# Altium schematic sheet Amplifier.SchDoc
size A4; SheetNumber: 4; SheetTotal: 7
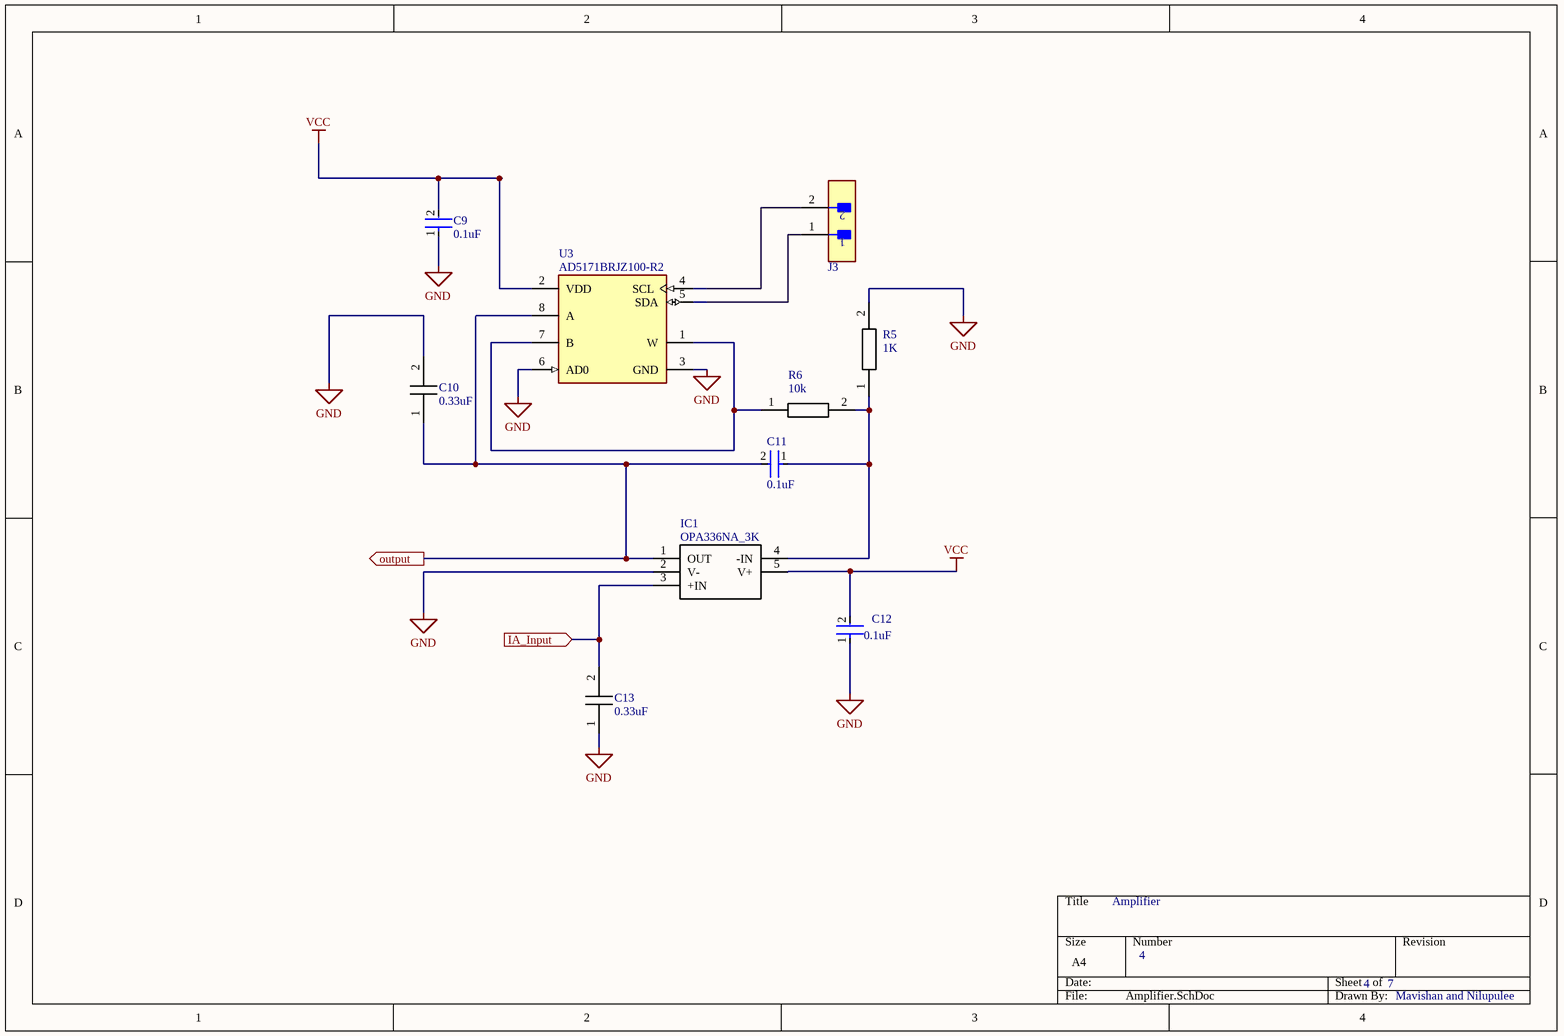
[diagram p0: Amplifier.SchDoc]

## Parts
C9  0.1uF  [FP-C1206C-EB-MFG]
C10  Parameter 1: 0.33uF  [CAPC3216X127N]  (hidden comment: 12063C334MAT2A)
C11  0.1uF  [FP-C1206C-EB-MFG]
C12  0.1uF  [FP-C1206C-EB-MFG]
C13  Parameter 1: 0.33uF  [CAPC3216X127N]  (hidden comment: 12063C334MAT2A)
IC1  OPA336NA_3K  [SOT95P280X145-5N]
J3  M20-9990246  [FP-M20-9990246-MFG]  (value not drawn)
R5  Parameter 1: 1K  [RESC3216X70N]  (hidden comment: ERA8AEB102V)
R6  Parameter 1: 10k  [RESC3216X70N]  (hidden comment: ERA-8AEB103V)
U3  AD5171BRJZ100-R2  [FP-RJ-8-IPC_A]

## Ports
IA_Input (in, see Main PCB[3B]), output (out, see Main PCB[3B])

## Nets
GND: C9.1 C10.2(C2) C12.1 C13.1(C1) IC1.2(V-) R5.2 U3.3(GND) U3.6(AD0)
VCC: C9.2 C12.2 IC1.5(V+) U3.2(VDD)
IA_Input: C13.2(C2) IC1.3(+IN) ; port IA_Input
output: C10.1(C1) C11.2 IC1.1(OUT) U3.8(A) ; port output
NetC11_1: C11.1 IC1.4(-IN) R5.1 R6.2
NetJ3_1: J3.1 U3.5(SDA)
NetJ3_2: J3.2 U3.4(SCL)
NetR6_1: R6.1 U3.1(W) U3.7(B)

## Notes on the sheet
- Amplifier
- 4
- 7
- Mavishan and Nilupulee

## Library data of the parts
C9 C11 C12 = CMP-1037-04186-2: CAP CER 0.1UF 25V C0G/NP0 1206; Manufacturer: KEMET; Manufacturer Part Number: C1206C104F3GACTU; Material: Ceramic; Value: 0.10 μF; Temperature Characteristic: C0G; Temperature Coefficient: 15%; Tolerance: 0.01; Automotive Grade: Grade 0; Device Class L3: Ceramic Capacitors; Voltage Rating: 25 V; Temperature Range Low: -55°C; RoHS: TRUE; Package: C1206C-EB; Category: Cap; Lead Free: Yes; ComponentLink2URL: https://content.kemet.com/datasheets/KEM_C1007_X8R_ULTRA_150C_SMD.pdf; Ipc Land Pattern Name: CAPC320160X78; Temperature Range High: +150°C; Height: 0.88mm; Digikey Description: CAP CER 0.1UF 25V C0G/NP0 1206; ComponentLink2Description: Datasheet; Capacitance: 0.10 μF; Mouser Description: Multilayer Ceramic Capacitors MLCC - SMD/SMT 25volts 0.1uF 1% C0G; Octopart: https://octopart.com/c1206c104f3gactu-kemet-13149870; Device Class L1: Passive Components; Device Class L2: Capacitors; Automotive: Yes; Temperature: -55°C to +150°C
C10 C13 = 12063C334MAT2A: Capacitor; Manufacturer_Name: Kyocera AVX; Manufacturer_Part_Number: 12063C334MAT2A; Mouser Part Number: 581-12063C334MAT2A; Mouser Price/Stock: https://www.mouser.co.uk/ProductDetail/AVX/12063C334MAT2A?qs=UY55afH%252BLTTA4%2F7p5aIkng%3D%3D
IC1 = OPA336NA_3K: Integrated Circuit; Manufacturer_Name: Texas Instruments; Manufacturer_Part_Number: OPA336NA/3K; Datasheet Link: http://www.ti.com/lit/gpn/OPA336; Height: 1.45mm; Mouser Part Number: 595-OPA336NA/3K; Mouser Price/Stock: https://www.mouser.co.uk/ProductDetail/Texas-Instruments/OPA336NA-3K?qs=7nS3%252BbEUL6vwF%252Byt2%2F21Rw%3D%3D; Arrow Part Number: OPA336NA/3K; Arrow Price/Stock: https://www.arrow.com/en/products/opa336na3k/texas-instruments?region=nac
J3 = CMP-15831-000009-1: CONN HEADER VERT 2POS 2.54MM; Manufacturer: Harwin; Conn Gender: Male; Conn Orientation: Vertical; Number Of Contacts: 2; Current Rating: 3A; ComponentLink2URL: https://cdn.harwin.com/pdfs/M20-999.pdf; ComponentLink2Description: Datasheet; Package: M20-9990246; Temperature: -40°C to +105°C; Octopart: https://octopart.com/m20-9990246-harwin-2590635; Mouser Description: 2.54mm (0.1") Pitch SIL Vertical PC Tail Pin Header, 6.1mm mating pin height, tin, 2 contacts; Temperature Range High: +105°C; Device Class L1: Connectors; RoHS: TRUE; Automotive: No; Height: 8.99mm; Number Of Rows: 1; Contact Material: Tin,Nickel; Category: Conn; Pitch: 2.54mm; Lead Free: Yes; Digikey Description: CONN HEADER VERT 2POS 2.54MM; Manufacturer Part Number: M20-9990246; Temperature Range Low: -40°C; Device Class L3: unset; Device Class L2: Headers and Wire Housings
R5 = ERA8AEB102V: Resistor; Manufacturer_Name: Panasonic; Datasheet Link: https://industrial.panasonic.com/cdbs/www-data/pdf/RDM0000/AOA0000C307.pdf; Height: 0.7mm; Manufacturer_Part_Number: ERA8AEB102V; Arrow Part Number: ERA8AEB102V; Arrow Price/Stock: https://www.arrow.com/en/products/era-8aeb102v/panasonic
R6 = ERA-8AEB103V: Resistor; Manufacturer_Name: Panasonic; Datasheet Link: https://industrial.panasonic.com/cdbs/www-data/pdf/RDM0000/AOA0000C307.pdf; Height: 0.7mm; Manufacturer_Part_Number: ERA-8AEB103V; Mouser Part Number: 667-ERA-8AEB103V; Mouser Price/Stock: https://www.mouser.co.uk/ProductDetail/Panasonic/ERA-8AEB103V?qs=Ojoo2rCVP9QscDrGu5R0Gw%3D%3D; Arrow Part Number: ERA-8AEB103V; Arrow Price/Stock: https://www.arrow.com/en/products/era8aeb103v/panasonic?region=europe
U3 = CMP-00026-00446399-1: AD5171BRJZ100-R2 Digital Potentiometer 64POS 100kOhm Single Automotive 8-Pin SOT-23 T/R; Manufacturer Lifecycle Status: PRODUCTION; NexarPartId: 446399; -3db Bandwidth: 1.5MHz; Operating Supply Current: 4µA; Temperature Coefficient: 35ppm/°C; Number of Circuits: 1; Tolerance: 30%; Number of Taps: 64; Max Supply Voltage: 5.5V; Interface: I2C; Resistance: 100kΩ; Frequency: 400kHz; Max Junction Temperature (Tj): 150°C; Min Supply Voltage: 2.7V; Memory Type: Non-Volatile, Volatile; Width: 1.6mm; Lead Free: Contains Lead; Case/Package: SOT-23; Quiescent Current: 4µA; RoHS: Compliant; Taper: Linear; Min Operating Temperature: -40°C; Length: 2.9mm; Height: 1.3mm; Lifecycle Status: Production; Packaging: Cut Tape; Number of Pins: 8; REACH SVHC: No SVHC; Contact Plating: Gold; Nominal Supply Current: 4µA; Max Operating Temperature: 125°C; Number of Elements: 1; Mount: Surface Mount; Max Supply Current: 4µA; Schedule B: 8542390000, 8542390000; Number of Positions: 64; Operating Supply Voltage: 5.5V